# Altium schematic sheet PG02_Index and Revs.SchDoc: Index and Revisions
size B; Date: 2/10/2009; ApprovedBy: Touraj; DrawnBy: Juan A. Nadal; Engineer: Touraj; Organization: ActiveWave; Address1: 902 Clint Moore Rd., Suite 118; Address2: Boca Raton; Address3: FL, 33487; Address4: 561-999-9422; DocumentNumber: 2; Revision: 19; SheetNumber: 2; SheetTotal: 5; PageSetup: Record=PageOptions|CenterHorizontal=True|CenterVertical=True|PrintScale=0.68|XCorrection=1.00|YCorrection=1.00|PrintKind=0|BorderSize=5000000|LeftOffset=0|BottomOffset=0|Orientation=2|PaperLength=1000|PaperWidth=1000|Scale=100|PaperSource=7|PrintQuality=-4|MediaType=1|DitherType=10|PaperKind=Letter|PrintScaleMode=1; Project: TRX-101
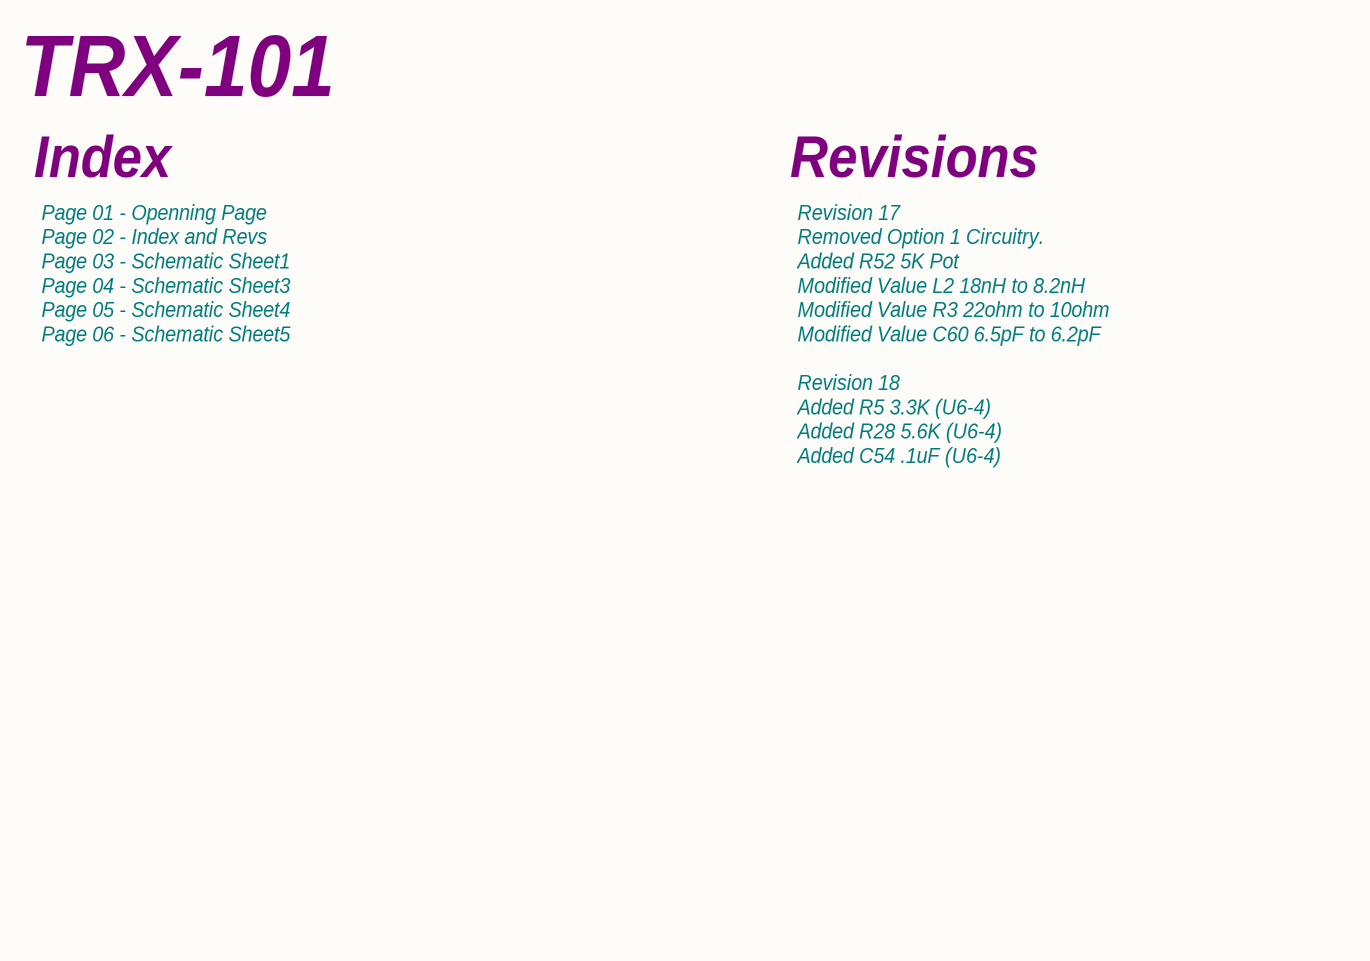
[diagram p0: PG02_Index and Revs.SchDoc]

## Notes on the sheet
- TRX-101
- Index
- Revisions
- Page 01 - Openning Page
  Page 02 - Index and Revs
  Page 03 - Schematic Sheet1
  Page 04 - Schematic Sheet3
  Page 05 - Schematic Sheet4
  Page 06 - Schematic Sheet5
- Revision 17
  Removed Option 1 Circuitry.
  Added R52 5K Pot
  Modified Value L2 18nH to 8.2nH
  Modified Value R3 22ohm to 10ohm
  Modified Value C60 6.5pF to 6.2pF
  Revision 18
  Added R5 3.3K (U6-4)
  Added R28 5.6K (U6-4)
  Added C54 .1uF (U6-4)
- APPROVALS
- DATE
- Title:
- Drawn:
- Checked:
- Release:
- Date:
- Size:
- Sheet Name:
- B
- Number:
- Time:
- Revision:
- Sheet
- of
- File: